# EAGLE design 1dpong (EAGLE 6.0)
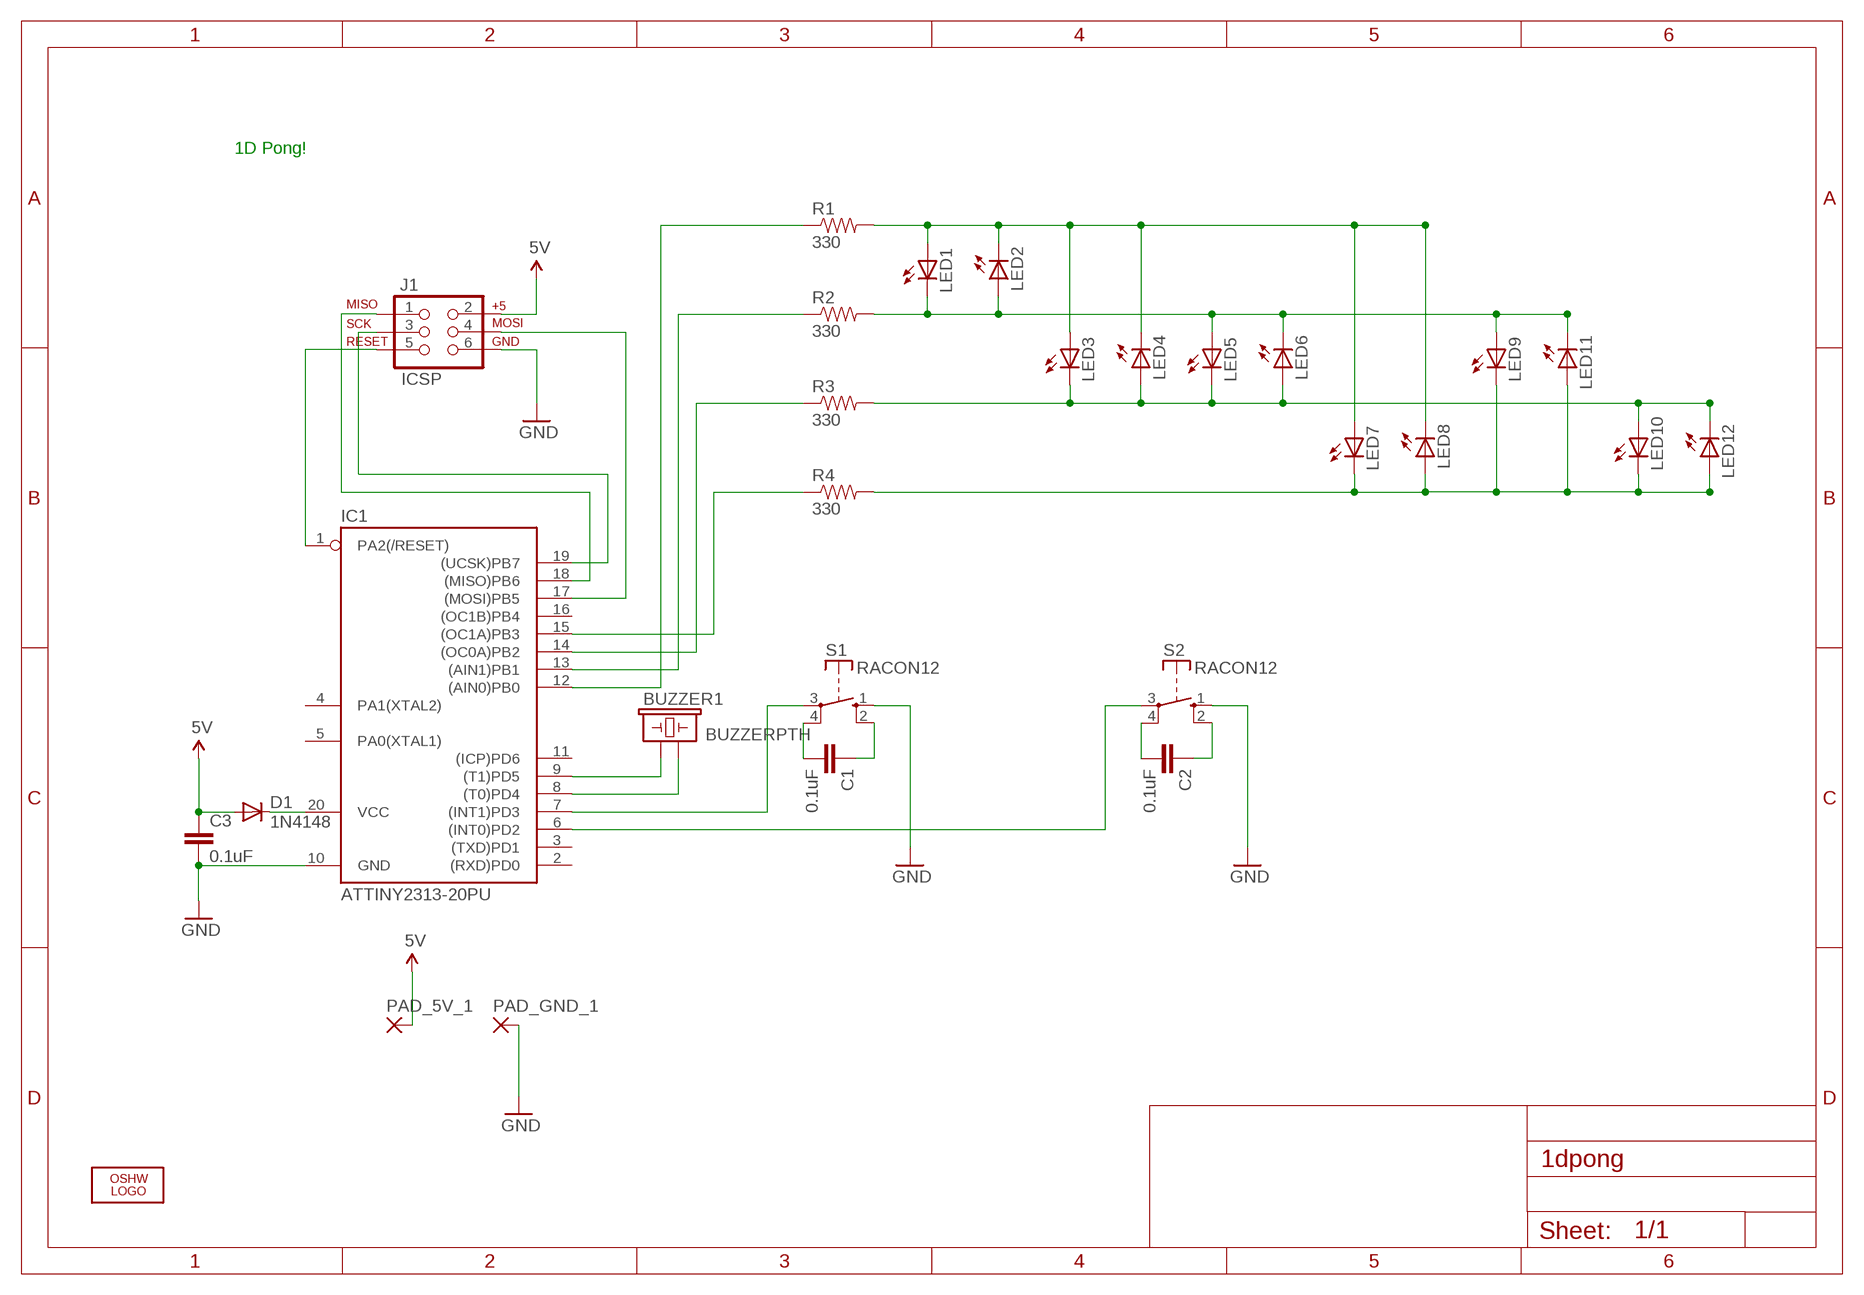
[diagram p0: schematic, sheet 1]

## Parts
BUZZER1  BUZZERPTH  [BUZZER-12MM]
C1  0.1uF  CAPPTH  [CAP-PTH-SMALL]
C2  0.1uF  CAPPTH  [CAP-PTH-SMALL]
C3  0.1uF  CAPPTH  [CAP-PTH-SMALL]
D1  1N4148  DIODE1N4148  [DIODE-1N4148]
IC1  ATTINY2313-20PU  TINY2313-*P*  [DIL20]
J1  ICSP  AVR_SPI_PRG_6PTH  [2X3]
LED1  LED5MM  [LED5MM]
LED2  LED5MM  [LED5MM]
LED3  LED5MM  [LED5MM]
LED4  LED5MM  [LED5MM]
LED5  LED5MM  [LED5MM]
LED6  LED5MM  [LED5MM]
LED7  LED5MM  [LED5MM]
LED8  LED5MM  [LED5MM]
LED9  LED5MM  [LED5MM]
LED10  LED5MM  [LED5MM]
LED11  LED5MM  [LED5MM]
LED12  LED5MM  [LED5MM]
LOGO1  OSHW_LOGO_FILLX0150-NT  [OSHW_FILLX150_NOTEXT]
PAD_5V_1  WIREPAD1,6/0,9  [1,6/0,9]
PAD_GND_1  WIREPAD1,6/0,9  [1,6/0,9]
R1  330  RESISTORPTH-1/4W  [AXIAL-0.4]
R2  330  RESISTORPTH-1/4W  [AXIAL-0.4]
R3  330  RESISTORPTH-1/4W  [AXIAL-0.4]
R4  330  RESISTORPTH-1/4W  [AXIAL-0.4]
S1  RACON12  [RACON12]
S2  RACON12  [RACON12]

## Nets
5V: C3.1 D1.A J1.2 PAD_5V_1.1(P)
GND: C3.2 IC1.10(GND) J1.6 PAD_GND_1.1(P) S1.1(S) S2.1(S)
N$1: IC1.1(PA2(/RESET)) J1.5
N$2: IC1.19((UCSK)PB7) J1.3
N$3: LED1.A LED2.K(C) LED3.A LED4.K(C) LED7.A LED8.K(C) R1.P$2
N$4: LED1.K(C) LED2.A LED5.A LED6.K(C) LED9.A LED11.K(C) R2.P$2
N$5: LED3.K(C) LED4.A LED5.K(C) LED6.A LED10.A LED12.K(C) R3.P$2
N$6: BUZZER1.+ IC1.9((T1)PD5)
N$7: LED7.K(C) LED8.A LED9.K(C) LED10.K(C) LED11.A LED12.A R4.P$2
N$8: BUZZER1.- IC1.8((T0)PD4)
N$9: IC1.18((MISO)PB6) J1.1
N$10: IC1.15((OC1A)PB3) R4.P$1
N$11: D1.C IC1.20(VCC)
N$12: IC1.17((MOSI)PB5) J1.4
N$13: IC1.12((AIN0)PB0) R1.P$1
N$14: IC1.13((AIN1)PB1) R2.P$1
N$15: IC1.14((OC0A)PB2) R3.P$1
N$16: IC1.7((INT1)PD3) S1.3(P)
N$17: IC1.6((INT0)PD2) S2.3(P)
N$18: C1.2 S1.4(P)
N$19: C1.1 S1.2(S)
N$20: C2.2 S2.4(P)
N$21: C2.1 S2.2(S)
Unconnected: IC1.2((RXD)PD0) IC1.3((TXD)PD1) IC1.4(PA1(XTAL2)) IC1.5(PA0(XTAL1)) IC1.11((ICP)PD6) IC1.16((OC1B)PB4)

## Notes on the sheet
- 1D Pong!

## Library data of the parts
BUZZER1 = SparkFun-Electromechanical:BUZZER: Buzzer 12mm Spark Fun Electronics SKU : Comp-Buzzer
C1-C3 = SparkFun-Passives:CAP: Capacitor Standard 0603 ceramic capacitor, and 0.1" leaded capacitor.
D1 = SparkFun-DiscreteSemi:DIODE: Diode These are standard reverse protection diodes and small signal diodes. SMA package can handle up to about 1A. SOD-323 can handle about 200mA. What the SOD-323 package when ordering, there are some mfgs out there that are 5-pin packages.
IC1 = avr-6:TINY2313*: Atmel Tiny2313 2K Flash, 128 bytes EEPROM, 128 bytes RAM
J1 = SparkFun-Connectors:AVR_SPI_PRG_6: AVR ISP 6 Pin This is the reduced ISP connector for AVR programming. Common on Arduino. This footprint will take up less PCB space and can be used with a 10-pin to 6-pin adapter such as SKU: BOB-08508
LED1-LED12 = SparkFun-LED:LED: LEDs Standard schematic elements and footprints for 5mm, 3mm, 1206, and 0603 sized LEDs. 5mm - Spark Fun Electronics SKU : COM-00529 (and others)
LOGO1 = ohw-logo:OSHW_LOGO_FILL
PAD_5V_1 PAD_GND_1 = wirepad:WIREPAD: Wire PAD connect wire on PCB
R1-R4 = SparkFun-Passives:RESISTOR: Resistor Basic schematic elements and footprints for 0603, 1206, and PTH resistors.
S1 S2 = switch-misc:RACON12: ITT SWITCH

## Board
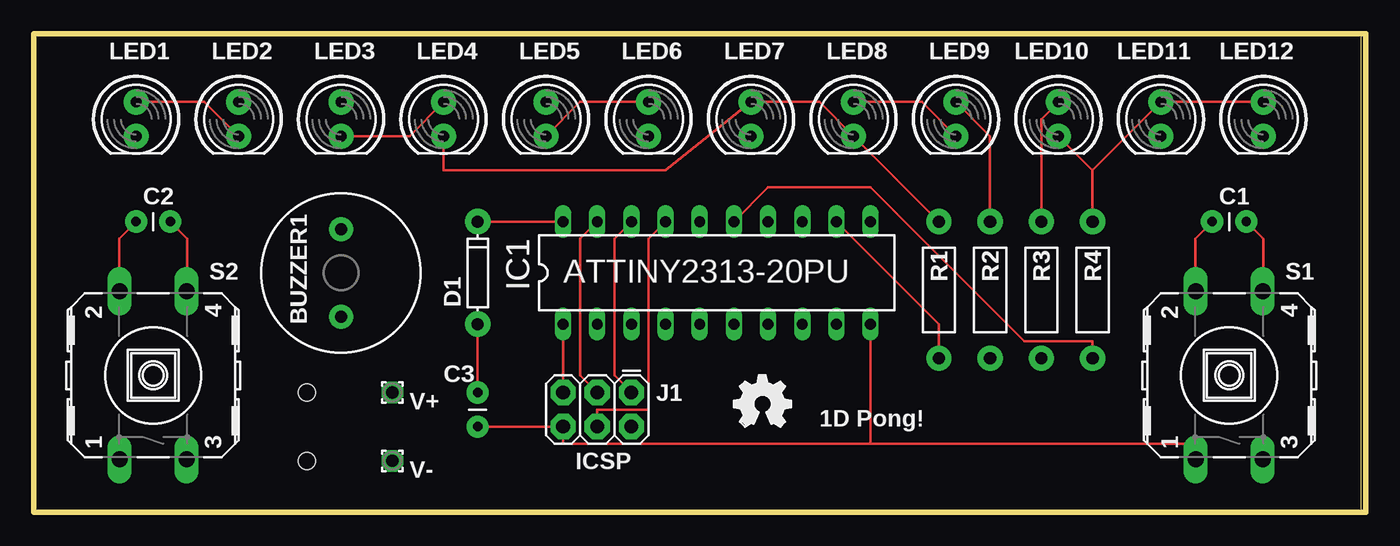
[diagram p1: board, top side]
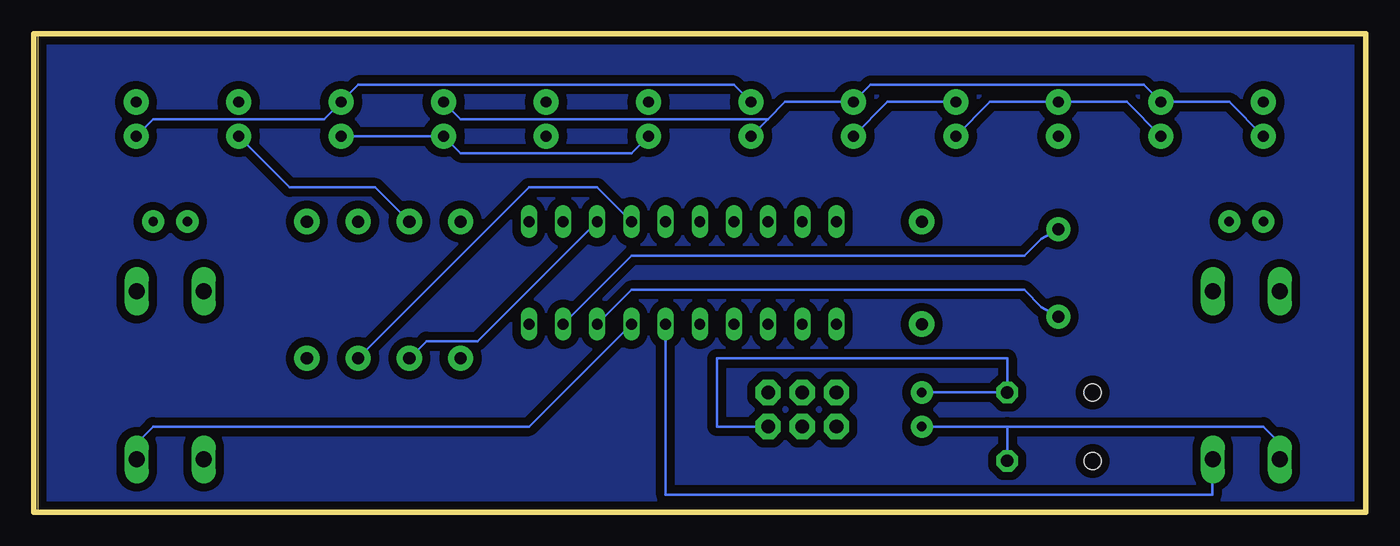
[diagram p2: board, bottom side, seen from below]

Size 99.06 x 35.56 mm. Coordinates in mm from the lower left corner, seen from the top.
Outline: 98.73,0 98.73,35.55 0,35.55 0,35.56
Outline: 0,35.56 0,0 98.73,0
Outline: 0,35.56 99.06,35.56 99.06,0 98.73,0
Copper layers (1*16): Top 0.0356mm / dielectric 1.5011mm / Bottom 0.0356mm
Design rules: minimum track width 6mil, minimum drill 13mil, track to track 6mil, track to pad 6mil, pad to pad 6mil, via to via 6mil, smd to smd 6mil, copper to edge 15mil, drill to drill 6mil, minimum pad ring 7mil, minimum via ring 7mil, stop-mask expansion 4mil, vias tented up to drill 0mil, thermal gap 10mil
Holes 1.27 mm at 20.32,8.89 20.32,3.81

### Footprints (pad centres in the part's own frame; a part is rotated, then mirrored left to right if it is on the bottom)
BUZZER-12MM = drill 0.9 pad 1.778: + 3.25,0; - -3.25,0
CAP-PTH-SMALL = drill 0.7 pad 1.651: 1 0,0; 2 2.54,0
DIODE-1N4148 = drill 0.9 pad 1.88: A -3.81,0; C 3.81,0
DIL20 = drill 0.813 long: 1 -11.43,-3.81; 2 -8.89,-3.81; 3 -6.35,-3.81; 4 -3.81,-3.81; 5 -1.27,-3.81; 6 1.27,-3.81; 7 3.81,-3.81; 8 6.35,-3.81; 9 8.89,-3.81; 10 11.43,-3.81; 11 11.43,3.81; 12 8.89,3.81; 13 6.35,3.81; 14 3.81,3.81; 15 1.27,3.81; 16 -1.27,3.81; 17 -3.81,3.81; 18 -6.35,3.81; 19 -8.89,3.81; 20 -11.43,3.81
2X3 = drill 1.016 pad 1.88 octagon: 1 0,0; 2 0,2.54; 3 2.54,0; 4 2.54,2.54; 5 5.08,0; 6 5.08,2.54
LED5MM = drill 0.813 pad 1.88: A -1.27,0; K 1.27,0
1,6/0,9 = drill 0.914 pad 1.6 octagon: 1 0,0
AXIAL-0.4 = drill 0.9 pad 1.88: P$1 -5.08,0; P$2 5.08,0
RACON12 = drill 1.194 long: 1 -6.248,2.489; 2 6.248,2.489; 3 -6.248,-2.489; 4 6.248,-2.489

### Placement (x,y rotation side)
BUZZER1  22.86,17.78 90 top
C1  87.63,21.59 0 top
C2  7.62,21.59 0 top
C3  33.02,8.89 270 top
D1  33.02,17.78 90 top
IC1  50.8,17.78 0 top
J1  44.45,8.89 180 top
LED1  7.62,29.21 270 top
LED2  15.24,29.21 270 top
LED3  22.86,29.21 270 top
LED4  30.48,29.21 270 top
LED5  38.1,29.21 270 top
LED6  45.72,29.21 270 top
LED7  53.34,29.21 270 top
LED8  60.96,29.21 270 top
LED9  68.58,29.21 270 top
LED10  76.2,29.21 270 top
LED11  83.82,29.21 270 top
LED12  91.44,29.21 270 top
LOGO1  52.07,6.35 0 top
PAD_5V_1  26.67,8.89 0 top
PAD_GND_1  26.67,3.81 0 top
R1  67.31,16.51 90 top
R2  71.12,16.51 90 top
R3  74.93,16.51 90 top
R4  78.74,16.51 90 top
S1  88.9,10.16 90 top
S2  8.89,10.16 90 top

### Tracks (layer width: path | path; a pad name or v marks a point on that pad's centre or on a via)
5V
  Top 0.203: C3.1 D1.A
  Bottom 0.203: C3.1 PAD_5V_1.1 26.67,11.43 48.26,11.43 48.26,6.35 J1.2
GND
  Top 0.203: 62.23,5.08 IC1.10 | 62.23,5.08 39.37,5.08 J1.6 C3.2 | 62.23,5.08 86.36,5.08 S1.1
  Bottom 0.203: 26.67,6.35 PAD_GND_1.1 | C3.2 26.67,6.35 | 26.67,6.35 7.62,6.35 6.35,5.08 S2.1
N$1
  Top 0.203: J1.5 IC1.1
N$2
  Top 0.203: IC1.19 40.64,20.32 40.64,10.16 J1.3
N$3
  Top 0.203: R1.P$2 LED8.K 58.42,30.48 LED7.A 46.99,25.4 30.48,25.4 LED4.K | LED1.A 12.7,30.48 LED2.K
  Bottom 0.203: LED2.K 17.78,30.48 LED3.A 27.94,30.48 LED4.K
N$4
  Top 0.203: LED9.A 71.12,27.94 R2.P$2
  Bottom 0.203: LED11.K 80.01,24.13 73.66,24.13 R2.P$2 | LED1.K 10.16,30.48 LED2.A 16.51,31.75 36.83,31.75 LED5.A 43.18,30.48 44.45,29.21 | 44.45,29.21 LED6.K | LED9.A 67.31,29.21 44.45,29.21
N$5
  Top 0.203: R3.P$2 74.93,29.21 LED10.A | LED3.K 27.94,27.94 LED4.A | LED6.A 40.64,30.48 LED5.K
  Bottom 0.203: LED12.K 90.17,29.21 77.47,29.21 LED10.A 74.93,31.75 46.99,31.75 LED6.A | LED5.K 35.56,30.48 LED4.A
N$6
  Bottom 0.203: IC1.9 54.61,19.05 25.4,19.05 24.13,20.32 BUZZER1.+
N$7
  Top 0.203: LED8.A 66.04,30.48 LED9.K | 78.74,25.4 LED10.K | R4.P$2 78.74,25.4 | 78.74,25.4 LED11.A LED12.A
  Bottom 0.203: LED7.K 54.61,26.67 67.31,26.67 LED9.K LED10.K
N$8
  Bottom 0.203: IC1.8 54.61,16.51 25.4,16.51 24.13,15.24 BUZZER1.-
N$9
  Top 0.203: IC1.18 43.18,20.32 43.18,10.16 J1.1
N$10
  Top 0.203: IC1.15 54.61,24.13 62.23,24.13 73.66,12.7 78.74,12.7 R4.P$1
N$11
  Top 0.203: D1.C IC1.20
N$12
  Top 0.203: IC1.17 45.72,20.32 45.72,7.62 41.91,7.62 J1.4
N$13
  Top 0.203: IC1.12 67.31,13.97 R1.P$1
N$14
  Bottom 0.203: IC1.13 66.04,12.7 69.85,12.7 R2.P$1
N$15
  Bottom 0.203: IC1.14 57.15,24.13 62.23,24.13 R3.P$1
N$16
  Bottom 0.203: IC1.7 62.23,6.35 90.17,6.35 91.44,5.08 S1.3
N$17
  Bottom 0.203: IC1.6 52.07,1.27 11.43,1.27 11.43,3.81 S2.3
N$18
  Top 0.203: C1.2 91.44,20.32 91.44,16.51 S1.4
N$19
  Top 0.203: C1.1 86.36,20.32 86.36,16.51 S1.2
N$20
  Top 0.203: C2.2 11.43,20.32 11.43,16.51 S2.4
N$21
  Top 0.203: C2.1 6.35,20.32 6.35,16.51 S2.2
N$22
  pour Bottom (isolate 0.61): 0,35.56 99.06,35.56 99.06,0 0,0

### Text on the board
_tsilk: LED1 | LED2 | LED3 | LED4 | LED5 | LED6 | LED7 | LED8 | LED9 | LED10 | LED11 | LED12 | C2 | C1 | IC1 | S2 | S1 | ATTINY2313-20PU | R1 | R2 | R3 | R4 | D1 | 2 | 4 | BUZZER1 | 2 | 4 | C3 | J1 | V+ | 1D Pong! | 1 | 3 | ICSP | 1 | 3 | V-